# Altium schematic sheet Zswagg.SchDoc
size A4; SheetNumber: 2; SheetTotal: 2
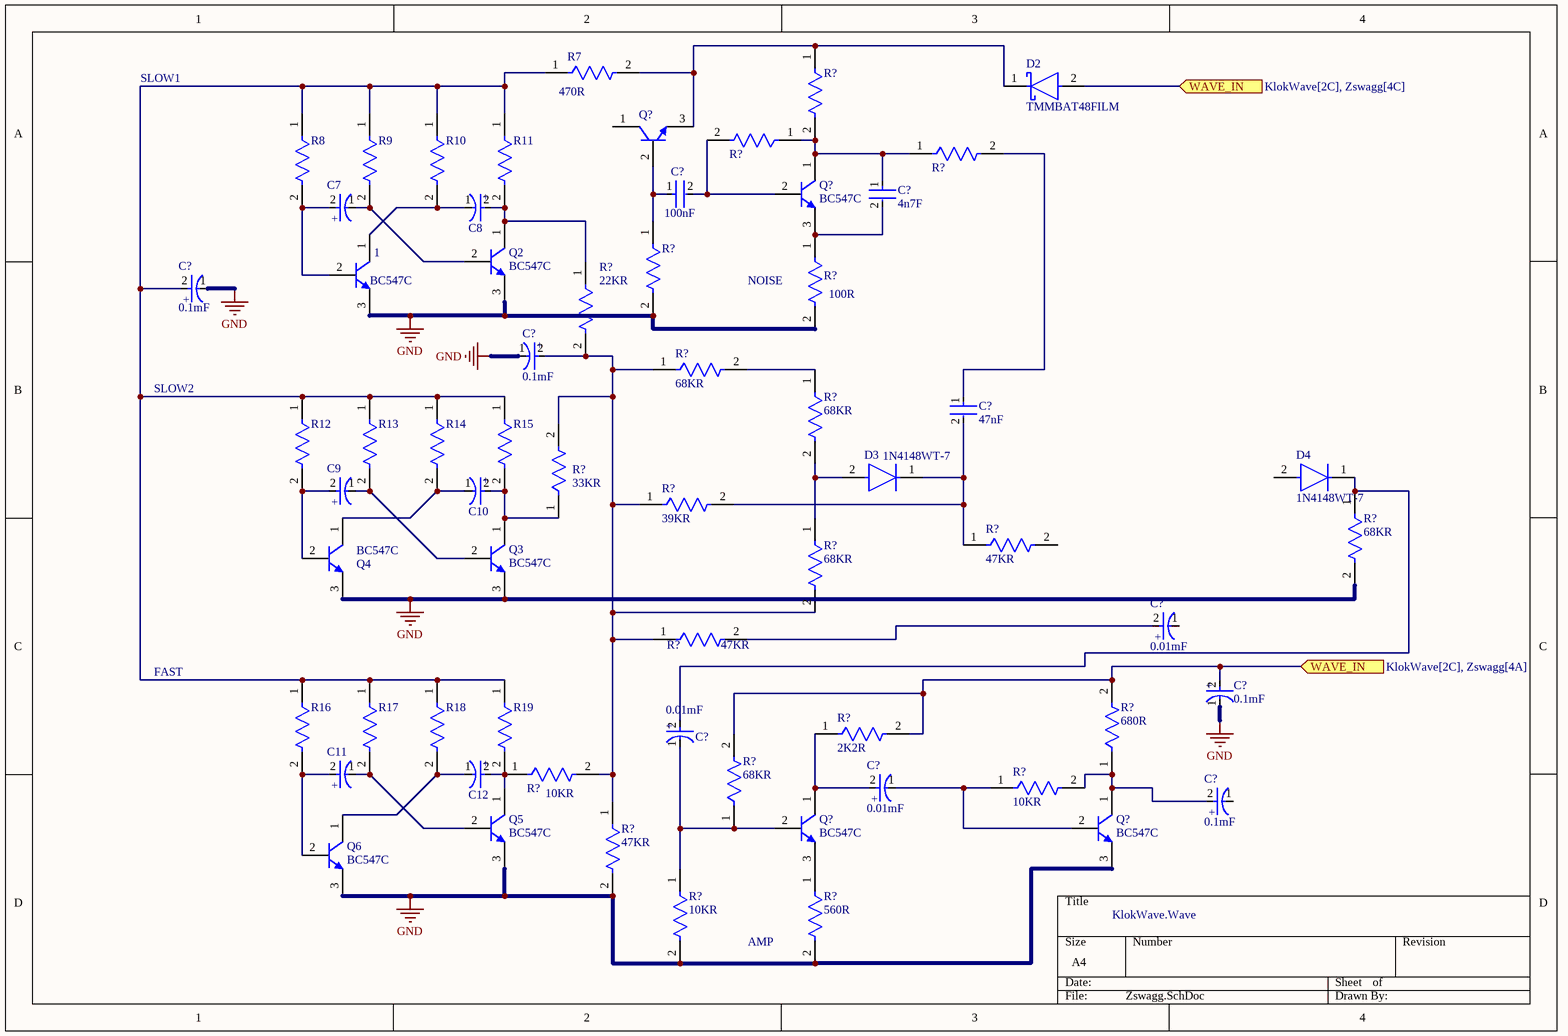
[diagram p0: Zswagg.SchDoc]

## Parts
(Parts that share a designator on the sheet are numbered #1, #2 ... from top to bottom, then left to right.)
1  BC547C  [ONSC-TO-92-3-29-11]
C7  TAJR684K016RNJ  [FP-TAJR-MFG]  (value not drawn)
C8  TAJR684K016RNJ  [FP-TAJR-MFG]  (value not drawn)
C9  TAJR684K016RNJ  [FP-TAJR-MFG]  (value not drawn)
C10  TAJR684K016RNJ  [FP-TAJR-MFG]  (value not drawn)
C11  TAJR684K016RNJ  [FP-TAJR-MFG]  (value not drawn)
C12  TAJR684K016RNJ  [FP-TAJR-MFG]  (value not drawn)
C?#1  Capacitance: 4n7F  [FP-CL21-IPC_A]  (hidden comment: CL21C221FBANNNC)
C?#2  Capacitance: 100nF  [FP-CL21-IPC_A]  (hidden comment: CL21C221FBANNNC)
C?#3  Capacitance: 0.1mF  [FP-TAJR-MFG]  (hidden comment: TAJR684K016RNJ)
C?#4  Capacitance: 0.1mF  [FP-TAJR-MFG]  (hidden comment: TAJR684K016RNJ)
C?#5  Capacitance: 47nF  [FP-CL21-IPC_A]  (hidden comment: CL21C221FBANNNC)
C?#6  Capacitance: 0.01mF  [FP-TAJR-MFG]  (hidden comment: TAJR684K016RNJ)
C?#7  Capacitance: 0.1mF  [FP-TAJR-MFG]  (hidden comment: TAJR684K016RNJ)
C?#8  Capacitance: 0.01mF  [FP-TAJR-MFG]  (hidden comment: TAJR684K016RNJ)
C?#9  Capacitance: 0.01mF  [FP-TAJR-MFG]  (hidden comment: TAJR684K016RNJ)
C?#10  Capacitance: 0.1mF  [FP-TAJR-MFG]  (hidden comment: TAJR684K016RNJ)
D2  TMMBAT48FILM  [FP-MINIMELF-MFG]
D3  1N4148WT-7  [FP-SOD523-MFG]
D4  1N4148WT-7  [FP-SOD523-MFG]
Q2  BC547C  [ONSC-TO-92-3-29-11]
Q3  BC547C  [ONSC-TO-92-3-29-11]
Q4  BC547C  [ONSC-TO-92-3-29-11]
Q5  BC547C  [ONSC-TO-92-3-29-11]
Q6  BC547C  [ONSC-TO-92-3-29-11]
Q?#1  BC547C  [ONSC-TO-92-3-29-11]  (value not drawn)
Q?#2  BC547C  [ONSC-TO-92-3-29-11]
Q?#3  BC547C  [ONSC-TO-92-3-29-11]
Q?#4  BC547C  [ONSC-TO-92-3-29-11]
R7  Resistance: 470R  [FP-CR0805-IPC_A]  (hidden comment: CR0805-FX-22R6ELF)
R8  CR0805-FX-22R6ELF  [FP-CR0805-IPC_A]  (value not drawn)
R9  CR0805-FX-22R6ELF  [FP-CR0805-IPC_A]  (value not drawn)
R10  CR0805-FX-22R6ELF  [FP-CR0805-IPC_A]  (value not drawn)
R11  CR0805-FX-22R6ELF  [FP-CR0805-IPC_A]  (value not drawn)
R12  CR0805-FX-22R6ELF  [FP-CR0805-IPC_A]  (value not drawn)
R13  CR0805-FX-22R6ELF  [FP-CR0805-IPC_A]  (value not drawn)
R14  CR0805-FX-22R6ELF  [FP-CR0805-IPC_A]  (value not drawn)
R15  CR0805-FX-22R6ELF  [FP-CR0805-IPC_A]  (value not drawn)
R16  CR0805-FX-22R6ELF  [FP-CR0805-IPC_A]  (value not drawn)
R17  CR0805-FX-22R6ELF  [FP-CR0805-IPC_A]  (value not drawn)
R18  CR0805-FX-22R6ELF  [FP-CR0805-IPC_A]  (value not drawn)
R19  CR0805-FX-22R6ELF  [FP-CR0805-IPC_A]  (value not drawn)
R?#1  CR0805-FX-22R6ELF  [FP-CR0805-IPC_A]  (value not drawn)
R?#2  CR0805-FX-22R6ELF  [FP-CR0805-IPC_A]  (value not drawn)
R?#3  CR0805-FX-22R6ELF  [FP-CR0805-IPC_A]  (value not drawn)
R?#4  CR0805-FX-22R6ELF  [FP-CR0805-IPC_A]  (value not drawn)
R?#5  Resistance: 100R  [FP-CR0805-IPC_A]  (hidden comment: CR0805-FX-22R6ELF)
R?#6  Resistance: 22KR  [FP-CR0805-IPC_A]  (hidden comment: CR0805-FX-22R6ELF)
R?#7  Resistance: 68KR  [FP-CR0805-IPC_A]  (hidden comment: CR0805-FX-22R6ELF)
R?#8  Resistance: 68KR  [FP-CR0805-IPC_A]  (hidden comment: CR0805-FX-22R6ELF)
R?#9  Resistance: 68KR  [FP-CR0805-IPC_A]  (hidden comment: CR0805-FX-22R6ELF)
R?#10  Resistance: 39KR  [FP-CR0805-IPC_A]  (hidden comment: CR0805-FX-22R6ELF)
R?#11  Resistance: 33KR  [FP-CR0805-IPC_A]  (hidden comment: CR0805-FX-22R6ELF)
R?#12  Resistance: 68KR  [FP-CR0805-IPC_A]  (hidden comment: CR0805-FX-22R6ELF)
R?#13  Resistance: 47KR  [FP-CR0805-IPC_A]  (hidden comment: CR0805-FX-22R6ELF)
R?#14  Resistance: 47KR  [FP-CR0805-IPC_A]  (hidden comment: CR0805-FX-22R6ELF)
R?#15  Resistance: 2K2R  [FP-CR0805-IPC_A]  (hidden comment: CR0805-FX-22R6ELF)
R?#16  Resistance: 10KR  [FP-CR0805-IPC_A]  (hidden comment: CR0805-FX-22R6ELF)
R?#17  Resistance: 680R  [FP-CR0805-IPC_A]  (hidden comment: CR0805-FX-22R6ELF)
R?#18  Resistance: 10KR  [FP-CR0805-IPC_A]  (hidden comment: CR0805-FX-22R6ELF)
R?#19  Resistance: 47KR  [FP-CR0805-IPC_A]  (hidden comment: CR0805-FX-22R6ELF)
R?#20  Resistance: 68KR  [FP-CR0805-IPC_A]  (hidden comment: CR0805-FX-22R6ELF)
R?#21  Resistance: 10KR  [FP-CR0805-IPC_A]  (hidden comment: CR0805-FX-22R6ELF)
R?#22  Resistance: 560R  [FP-CR0805-IPC_A]  (hidden comment: CR0805-FX-22R6ELF)

## Ports
WAVE_IN (in, see KlokWave[2C], Zswagg[4A]), WAVE_IN (in, see KlokWave[2C], Zswagg[4C])

## Nets
GND: 1.3(E) C?#3.1(C) C?#4.1(C) C?#7.1(C) Q2.3(E) Q3.3(E) Q4.3(E) Q5.3(E) Q6.3(E) Q?#4.3(E) R?#4.2 R?#5.2 R?#9.2 R?#19.2 R?#21.2 R?#22.2
WAVE_IN: C?#7.2(A) D2.2(A) R?#15.2 R?#17.2 R?#20.2 ; port WAVE_IN
Net1_1: 1.1(C) C8.1(C) R10.2
Net1_2: 1.2(B) C7.2(A) R8.2
NetC7_1: C7.1(C) Q2.2(B) R9.2
NetC8_2: C8.2(A) Q2.1(C) R11.2 R?#6.1
NetC9_1: C9.1(C) Q3.2(B) R13.2
NetC9_2: C9.2(A) Q4.2(B) R12.2
NetC10_1: C10.1(C) Q4.1(C) R14.2
NetC10_2: C10.2(A) Q3.1(C) R15.2 R?#11.1
NetC11_1: C11.1(C) Q5.2(B) R17.2
NetC11_2: C11.2(A) Q6.2(B) R16.2
NetC12_1: C12.1(C) Q6.1(C) R18.2
NetC12_2: C12.2(A) Q5.1(C) R19.2 R?#16.1
NetC?#1_1: C?#1.1 Q?#2.1(C) R?#1.2 R?#2.1 R?#3.1
NetC?#1_2: C?#1.2 Q?#2.3(E) R?#5.1
NetC?#2_1: C?#2.1 Q?#1.2(B) R?#4.1
NetC?#2_2: C?#2.2 Q?#2.2(B) R?#2.2
NetC?#3_2: C?#3.2(A) R7.1 R8.1 R9.1 R10.1 R11.1 R12.1 R13.1 R14.1 R15.1 R16.1 R17.1 R18.1 R19.1
NetC?#4_2: C?#4.2(A) R?#6.2 R?#7.1 R?#10.1 R?#11.2 R?#12.2 R?#14.1 R?#16.2 R?#19.1
NetC?#5_1: C?#5.1 R?#3.2
NetC?#5_2: C?#5.2 D3.1(C) R?#10.2 R?#13.1
NetC?#6_2: C?#6.2(A) R?#14.2
NetC?#8_1: C?#8.1(C) Q?#3.2(B) R?#20.1 R?#21.1
NetC?#8_2: C?#8.2(A) D4.1(C) R?#9.1
NetC?#9_1: C?#9.1(C) Q?#4.2(B) R?#18.1
NetC?#9_2: C?#9.2(A) Q?#3.1(C) R?#15.1
NetC?#10_2: C?#10.2(A) Q?#4.1(C) R?#17.1 R?#18.2
NetD2_1: D2.1(C) Q?#1.3(E) R7.2 R?#1.1
NetD3_2: D3.2(A) R?#8.2 R?#12.1
NetQ?#3_3: Q?#3.3(E) R?#22.1
NetR?#7_2: R?#7.2 R?#8.1

Not connected (* = marked no-connect by the designer): C?#6 1(C); C?#10 1(C); D4 2(A); Q?#1 1(C); R?#13 2

## Notes on the sheet
- SLOW1
- (near R?#5) NOISE
- SLOW2
- FAST
- KlokWave.Wave
- (near R?#22) AMP
- (in symbol CMP-04424-000151-1) +

## Library data of the parts
1 Q2-Q6 Q?#1-Q?#4 = CMP-1048-01437-1: BC547C: THT Amplifier Transistor, NPN Silicon, 3-Pin TO-92, Bulk Box; Manufacturer: On Semiconductor; IC Continuous (A): 0.1; fT Min (MHz): 150; Mounting Technology: Through Hole; ComponentLink1URL: http://www.onsemi.com/; ComponentLink1Description: Manufacturer URL; ComponentLink3URL: http://www.onsemi.cn/pub_link/Collateral/2N6426-D.PDF; DatasheetVersion: Rev. 7; PackageVersion: Rev. AM; Packing: Bulk Box; RoHS: FALSE; Polarity: NPN; PartNumber: BC547C; ComponentLink2URL: http://www.onsemi.com/pub_link/Collateral/BC546-D.PDF; ComponentLink3Description: Package Specification; PackageDescription: 3-Pin Transistor Outline, Body 4.825 x 3.685 mm, Pitch 1.27 mm; PackageReference: TO-92-3-29-11_AM_SL; ComponentLink2Description: Datasheet
C7-C12 C?#3 C?#4 C?#6-C?#10 = CMP-04424-000151-1: 680nF 16V  ±10% 25Ω 0805  SMD Tantalum Capacitor; Leakage Current: 500nA; Dissipation Factor: 4%; ESR (Equivalent Series Resistance): 25R; Mount: Surface Mount; Termination: SMD/SMT; Construction: Flat; Height: 1.2mm; Series: TAJ; Width: 1.3mm; Case Code (Imperial): 0805; Length: 2.05mm; Package Quantity: 2500; Tolerance: 10%; Min Operating Temperature: -55°C; Radiation Hardening: No; Lead Free: Lead Free; Case/Package: 0805; Height - Seated (Max): 0.047inch; Weight: 0.000194oz; Voltage Rating: 16V; Voltage Rating (DC): 16V; Dielectric Material: Tantalum; Features: General Purpose; Depth: 1.3mm; RoHS Compliant: Yes; Case Code (Metric): 2012; Packaging: Tape and Reel; Max Operating Temperature: 125°C; REACH SVHC: No SVHC
  C7-C12: Capacitance: 680nF
C?#1 C?#2 C?#5 = CMP-13271-000769-1: SMD cap nonpol: CL21 Series 0805 220pF 50V ±1% Tolerance C0G Multilayer Ceramic Chip Capacitor; Min Operating Temperature: -55°C; Radiation Hardening: No; Case/Package: 0805; Max Operating Temperature: 125°C; Height: 0.65mm; Depth: 1.25mm; Packaging: Tape and Reel; Thickness: 0.03inch; Voltage Rating: 50V; Case Code (Imperial): 0805; Lead Free: Lead Free; Width: 0.049inch; Tolerance: 1%; Mount: Surface Mount; Dielectric: C0G; Case Code (Metric): 2012; Material: Ceramic; Voltage Rating (DC): 50V; Package Quantity: 1; Length: 0.079inch
D2 = CMP-12187-000003-1: Rectifier Diode BAT48 SCHOTTKY 40V 350MA MINMELF; Manufacturer: STMicroelectronics; Max Surge Forward Current: 1.5A; Value: 20pF; Max Junction Temp: +125°C; Peak Reverse Current: 25uA; ComponentLink2Description: Datasheet; Manufacturer Part Number: TMMBAT48FILM; Height: 1.62mm; Forward Current: 350mA; Temperature: -65°C to +125°C; Max Repetitive Reverse Voltage: 40V; Category: Diode; Temperature Range Low: -65°C; Reverse Voltage: 40V; Device Class L3: Schottky Diodes; RoHS: TRUE; Digikey Description: DIODE SCHOTTKY 40V 350MA MINMELF; ComponentLink2URL: https://www.st.com/resource/en/datasheet/tmmbat48.pdf; Temperature Range High: +125°C; Octopart: https://octopart.com/tmmbat48film-stmicroelectronics-324396; Lead Free: Yes; Capacitance: 20pF; Device Class L1: Discrete Semiconductors; Device Class L2: Diodes; Automotive: No; Package: MINIMELF; Mouser Description: Schottky Diodes & Rectifiers 350mA 40 Volt
D3 D4 = CMP-2000-05518-3: Rectifier Diode 1N4148 GEN PURP 80V 125MA SOD523; Power Rating: 150mW; Peak Non-Repetitive Surge Current: 2A; Forward Voltage: 1.25V; Reverse Recovery Time: 4ns; Peak Reverse Current: 1uA; Max Repetitive Reverse Voltage (Vrrm): 100V; Capacitance: 2pF; Polarity: Standard; Element Configuration: Single; Forward Current: 250mA; Lead Free: Lead Free; Packaging: Tape and Reel; Length: 0.9mm; Min Operating Temperature: -65°C; Current Rating: 125mA; Max Reverse Voltage (DC): 80V; Width: 1.3mm; Package Quantity: 3000; Output Current: 125mA; Power Dissipation: 150mW; Max Operating Temperature: 150°C; Radiation Hardening: No; Average Rectified Current: 125mA; Height: 0.65mm; Voltage Rating (DC): 80V; Max Surge Current: 2A; Weight: 3.5E-05oz; Recovery Time: 4ns; Max Forward Surge Current (Ifsm): 2A; Contact Plating: Tin; Number of Pins: 2; Mount: Surface Mount; REACH SVHC: No SVHC
R7 R?#5-R?#22 = CMP-07231-006076-1: Thick Film Chip Resistors 0805 22.6Ω 0.125W 1% 100ppm/°C; Max Power Dissipation: 125mW; Voltage Rating: 150V; Package Quantity: 5000; Height: 0.024inch; Series: CR0805; Width: 0.049inch; Min Operating Temperature: -55°C; Max Operating Temperature: 155°C; Length: 2mm; Depth: 1.25mm; Military Standard: Not; Features: Moisture Resistant; Mount: Surface Mount; Tolerance: 1%; Termination: SMD/SMT; Contact Plating: Tin; Thickness: 508um; Resistor Type: Thick Film; Construction: Rectangular; Power Rating: 125mW; Case Code (Imperial): 0805; Case Code (Metric): 2012; Packaging: Tape and Reel; Temperature Coefficient: 100ppm/°C; Case/Package: 0805; Radiation Hardening: No; Number of Terminations: 2
R8-R19 R?#1-R?#4 = CMP-07231-006076-1: Thick Film Chip Resistors 0805 22.6Ω 0.125W 1% 100ppm/°C; Max Power Dissipation: 125mW; Voltage Rating: 150V; Resistance: 22.6R; Package Quantity: 5000; Height: 0.024inch; Series: CR0805; Width: 0.049inch; Min Operating Temperature: -55°C; Max Operating Temperature: 155°C; Length: 2mm; Depth: 1.25mm; Military Standard: Not; Features: Moisture Resistant; Mount: Surface Mount; Tolerance: 1%; Termination: SMD/SMT; Contact Plating: Tin; Thickness: 508um; Resistor Type: Thick Film; Construction: Rectangular; Power Rating: 125mW; Case Code (Imperial): 0805; Case Code (Metric): 2012; Packaging: Tape and Reel; Temperature Coefficient: 100ppm/°C; Case/Package: 0805; Radiation Hardening: No; Number of Terminations: 2